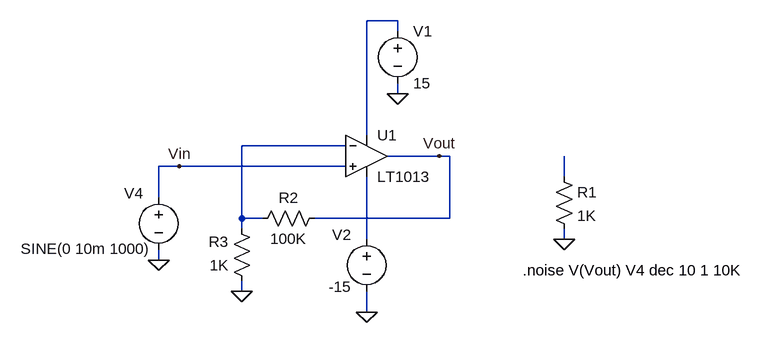
[diagram p0: schematic Opamp noise.asc]
Opamp noise.asc, the LTspice schematic file:
Version 4
SHEET 1 880 680
WIRE 288 -64 240 -64
WIRE 288 -48 288 -64
WIRE 288 48 288 32
WIRE 240 112 240 -64
WIRE 208 128 48 128
WIRE 352 144 272 144
WIRE 368 144 352 144
WIRE -48 160 -80 160
WIRE 208 160 -48 160
WIRE 544 176 544 144
WIRE -80 208 -80 160
WIRE 48 240 48 128
WIRE 80 240 48 240
WIRE 368 240 368 144
WIRE 368 240 160 240
WIRE 48 256 48 240
WIRE 240 272 240 176
WIRE 544 272 544 256
WIRE -80 304 -80 288
WIRE 48 352 48 336
WIRE 240 384 240 352
FLAG 288 48 0
FLAG 240 384 0
FLAG 352 144 Vout
FLAG 544 272 0
FLAG -80 304 0
FLAG 48 352 0
FLAG -48 160 Vin
SYMBOL Opamps\\LT1013 240 80 R0
SYMATTR InstName U1
SYMBOL voltage 288 -64 R0
WINDOW 123 0 0 Left 2
WINDOW 39 0 0 Left 2
SYMATTR InstName V1
SYMATTR Value 15
SYMBOL res 528 160 R0
SYMATTR InstName R1
SYMATTR Value 1K
SYMBOL voltage -80 192 R0
WINDOW 0 -53 9 Left 2
WINDOW 3 -212 95 Left 2
WINDOW 123 0 0 Left 2
WINDOW 39 0 0 Left 2
SYMATTR InstName V4
SYMATTR Value SINE(0 10m 1000)
SYMBOL voltage 240 256 R0
WINDOW 0 -53 9 Left 2
WINDOW 3 -58 89 Left 2
WINDOW 123 0 0 Left 2
WINDOW 39 0 0 Left 2
SYMATTR InstName V2
SYMATTR Value -15
SYMBOL res 176 224 R90
WINDOW 0 0 56 VBottom 2
WINDOW 3 32 56 VTop 2
SYMATTR InstName R2
SYMATTR Value 100K
SYMBOL res 64 352 R180
WINDOW 0 36 76 Left 2
WINDOW 3 36 40 Left 2
SYMATTR InstName R3
SYMATTR Value 1K
TEXT 480 320 Left 2 !.noise V(Vout) V4 dec 10 1 10K

The netlist it stands for:
* Opamp noise.asc
XU1 Vin N002 N001 N004 Vout LT1013  ; pins In+ In- V+ V- OUT
V1 N001 0 15
R1 N003 0 1K
V4 Vin 0 SINE(0 10m 1000)
V2 N004 0 -15
R2 Vout N002 100K
R3 0 N002 1K
.noise V(Vout) V4 dec 10 1 10K
.lib LTC.lib
.backanno
.end